# Altium schematic sheet uMultimeter_ExpDigiPower_Sch.SchDoc: MicroMultimeter_ExpDigiPower
size 127 x 127 mm; Author: Hom; CompanyName: KitSprout; DrawnBy: Hom; Engineer: Hom; Organization: KitSprout; Revision: A; SheetNumber: 1; SheetTotal: 1; License: CC BY-SA 4.0; Version: 1.0; LibVersion: 1.4; PageSetup: Record=PageOptions|CenterHorizontal=True|CenterVertical=True|PrintScale=1.00|XCorrection=1.00|YCorrection=1.00|PrintKind=0|BorderSize=5000000|LeftOffset=0|BottomOffset=0|Orientation=2|PaperLength=1000|PaperWidth=1000|Scale=100|PaperSource=7|PrintQuality=-3|MediaType=1|DitherType=10|PrintScaleMode=0|PaperKind=A4|PaperIndex=9
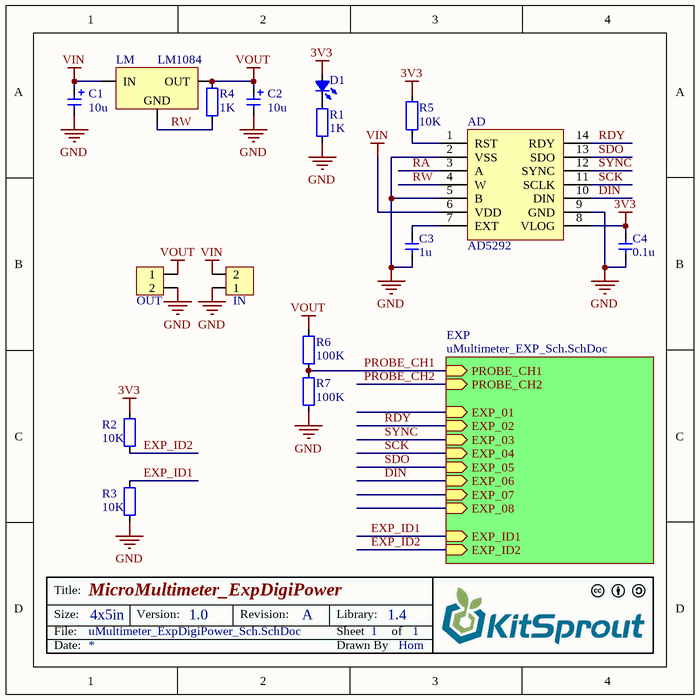
[diagram p0: uMultimeter_ExpDigiPower_Sch.SchDoc]

## Parts
AD  AD5292  [TSSOP_E170_P0.65_14]
C1  value 10u  [CAP_TAN_B1210]  (hidden comment: Cap_Tan_1210)
C2  value 10u  [CAP_TAN_B1210]  (hidden comment: Cap_Tan_1210)
C3  value 1u  [CAP_0603]  (hidden comment: Cap_0603)
C4  value 0.1u  [CAP_0603]  (hidden comment: Cap_0603)
D1  LED_0805  [LED_0805_BLUE]  (value not drawn)
IN  2Way_5  [2Way_5]  (value not drawn)
LM  LM1084  [TO-263-3]
OUT  2Way_5  [2Way_5]  (value not drawn)
R1  value 1K  [RES_0603]  (hidden comment: Res_0603)
R2  value 10K  [RES_0603]  (hidden comment: Res_0603)
R3  value 10K  [RES_0603]  (hidden comment: Res_0603)
R4  value 1K  [RES_0603]  (hidden comment: Res_0603)
R5  value 10K  [RES_0603]  (hidden comment: Res_0603)
R6  value 100K  [RES_0603]  (hidden comment: Res_0603)
R7  value 100K  [RES_0603]  (hidden comment: Res_0603)

## Sub-sheets
EXP = uMultimeter_EXP_Sch.SchDoc: PROBE_CH1 (in), PROBE_CH2 (in), EXP_01 (in), EXP_02 (in), EXP_03 (in), EXP_04 (in), EXP_05 (in), EXP_06 (in), EXP_07 (in), EXP_08 (in), EXP_ID1 (in), EXP_ID2 (in)

## Nets
3V3: AD.8(VLOG) C4.2 D1.1(A) R2.1 R5.2
GND: AD.2(VSS) AD.5(B) AD.9(GND) C1.2 C2.2 C3.1 C4.1 IN.1 OUT.2 R1.2 R3.2 R7.1
VIN: AD.6(VDD) C1.1 IN.2 LM.3(IN)
VOUT: C2.1 LM.2(OUT) OUT.1 R4.2 R6.2
DIN: AD.10(DIN) ; sheet EXP/EXP_06
EXP_ID1: R3.1 ; sheet EXP/EXP_ID1
EXP_ID2: R2.2 ; sheet EXP/EXP_ID2
PROBE_CH1: R6.1 R7.2 ; sheet EXP/PROBE_CH1
PROBE_CH2: sheet EXP/PROBE_CH2
RA: AD.3(A)
RDY: AD.14(RDY) ; sheet EXP/EXP_02
RW: AD.4(W) LM.1(ADJ) R4.1
SCK: AD.11(SCLK) ; sheet EXP/EXP_04
SDO: AD.13(SDO) ; sheet EXP/EXP_05
SYNC: AD.12(SYNC) ; sheet EXP/EXP_03
NetAD_1: AD.1(RST) R5.1
NetAD_7: AD.7(EXT) C3.2
NetD1_2: D1.2(K) R1.1

## Notes on the sheet
- Title:
- Size:
- Date:
- File:
- 4x5in
- Version:
- Revision:
- Sheet
- Drawn By
- Library:
- of
- (in symbol LM1084) GND

## Library data of the parts
AD = AD5292: Digital Pot
C1 C2 = Cap_Tan_1210: Capacitor
C3 C4 = Cap_0603: Capacitor
D1 = LED_0805: LED
IN OUT = 2Way_5: DB
LM = LM1084: Power
R1-R7 = Res_0603: Resistor